# EAGLE design PCBMINI2 (EAGLE 9.2.0)
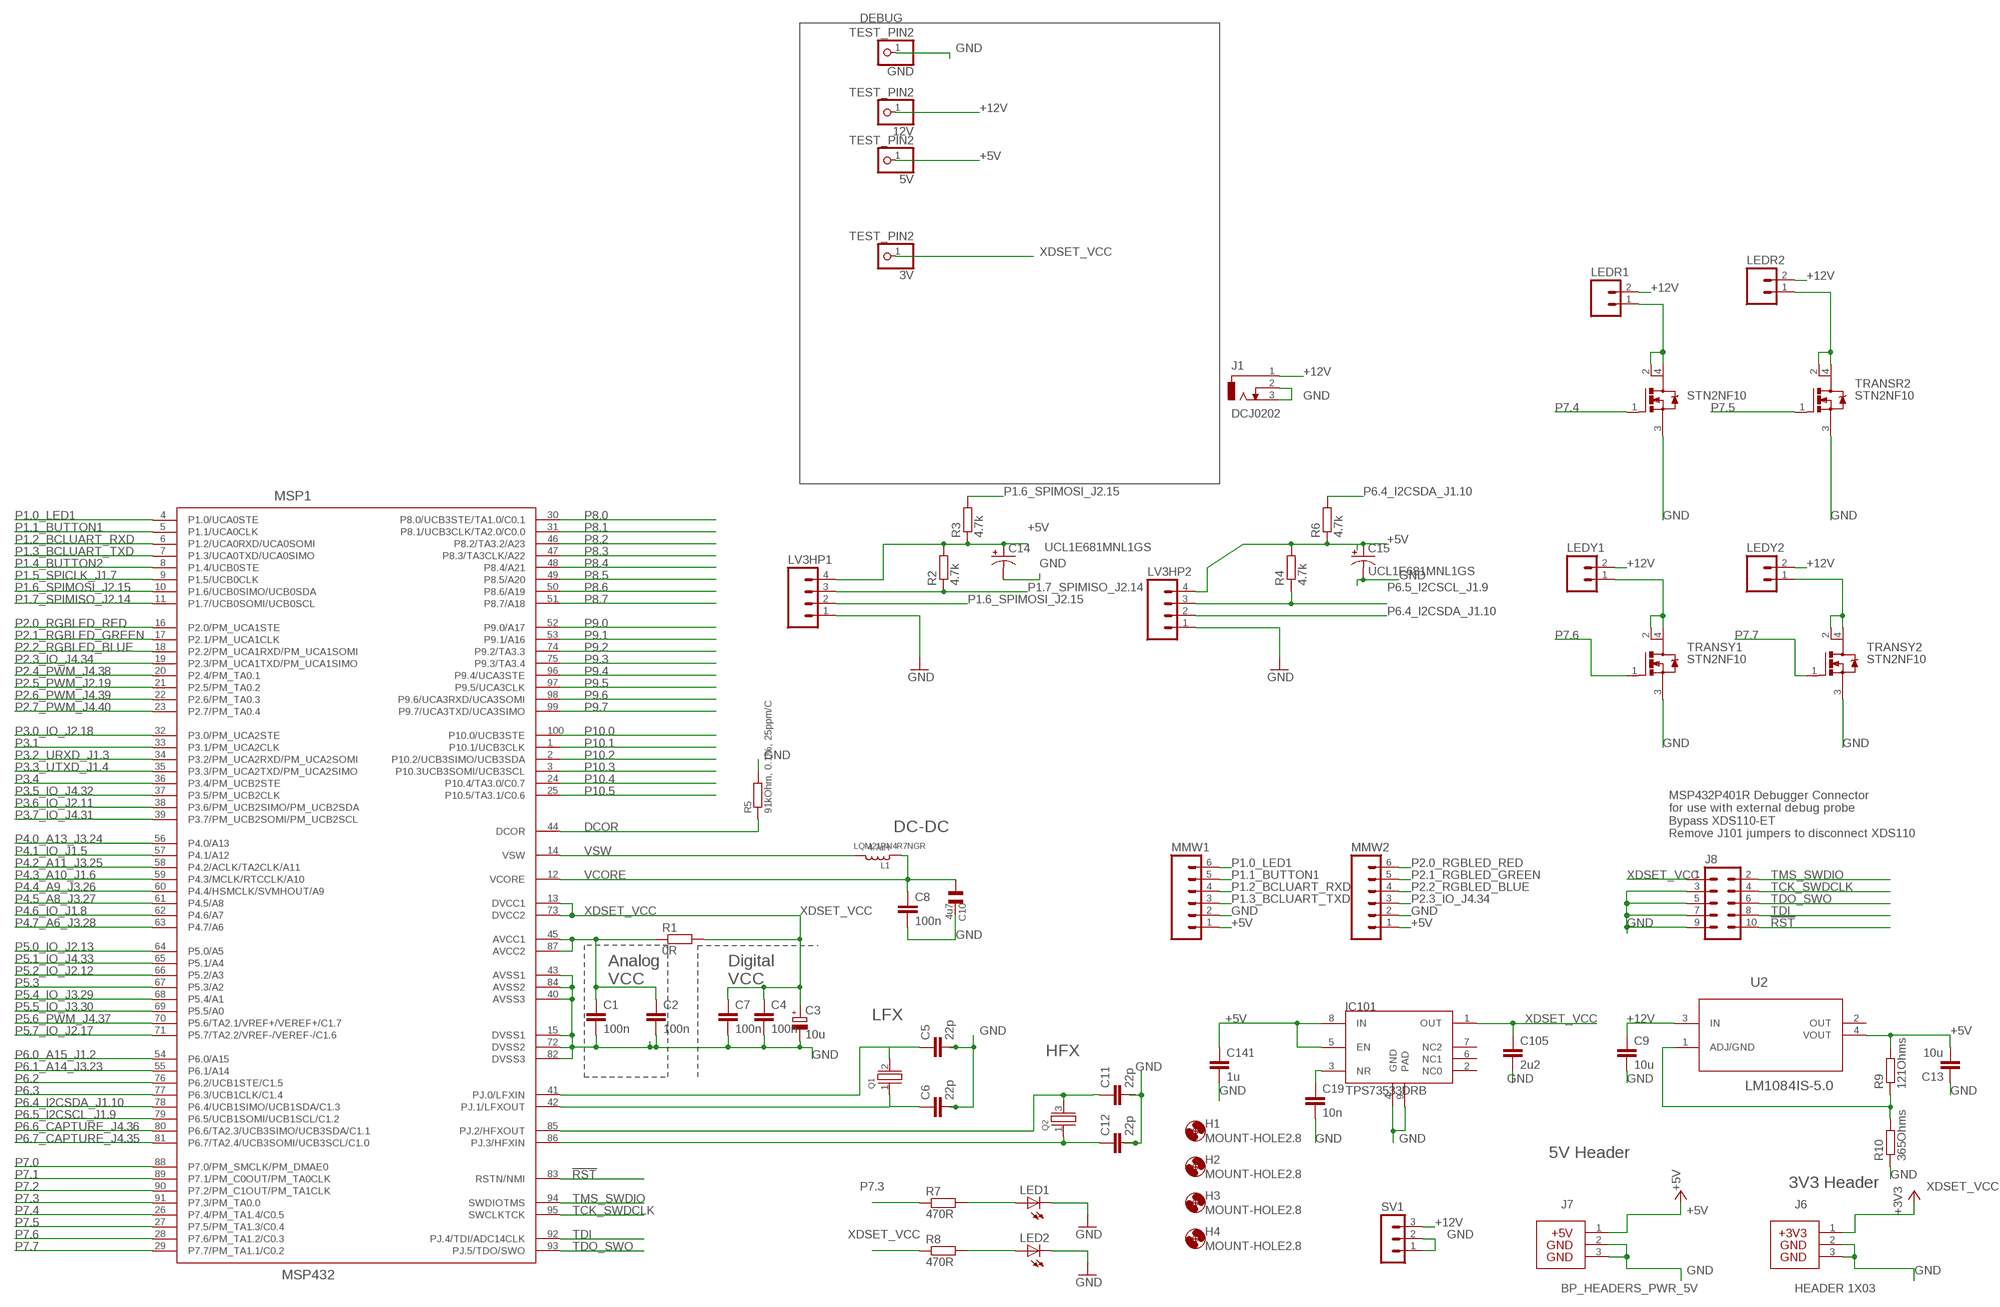
[diagram p0: schematic, sheet 1, part 1 of 2]
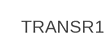
[diagram p1: schematic, sheet 1, part 2 of 2]

## Parts
3V  TEST_PIN2  PINHD-1X1  [1X01]
5V  TEST_PIN2  PINHD-1X1  [1X01]
12V  TEST_PIN2  PINHD-1X1  [1X01]
C1  100n  C  [C0805]
C2  100n  C  [C0805]
C3  10u  CPOL-EUA/3216-18R  [A/3216-18R]
C4  100n  C  [C0805]
C5  22p  C  [C0805]
C6  22p  C  [C0805]
C7  100n  C  [C0805]
C8  100n  C  [C0805]
C9  10u  C  [C0805]
C10  4u7  CSMD0805  [CSMD0805]
C11  22p  C  [C0805]
C12  22p  C  [C0805]
C13  10u  C  [C0805]
C14  UCL1E681MNL1GS  [CAPAE1030X1350N]
C15  UCL1E681MNL1GS  [CAPAE1030X1350N]
C19  10n  C-EUC0603  [C0603]
C105  2u2  C-EUC0603  [C0603]
C141  1u  C-EUC0603  [C0603]
GND  TEST_PIN2  PINHD-1X1  [1X01]
H1  MOUNT-HOLE2.8  [2,8]
H2  MOUNT-HOLE2.8  [2,8]
H3  MOUNT-HOLE2.8  [2,8]
H4  MOUNT-HOLE2.8  [2,8]
IC101  TPS73533DRB  TPS73633DRB  [SON8]
J1  DCJ0202  [DCJ0202]
J6  HEADER 1X03  BP_HEADERS_PWR_3V3100-TH  [3PIN_PWR_3V3]
J7  BP_HEADERS_PWR_5V  [3PIN_PWR_5V]
J8  DEBUG_ARM-10  [ARM-10]
L1  4.7uH  LQM2MP_G0  [0806]
LED1  LED_E  [LED_1206]
LED2  LED_E  [LED_1206]
LEDR1  MA02  [02PA]
LEDR2  MA02  [02PA]
LEDY1  MA02  [02PA]
LEDY2  MA02  [02PA]
LV3HP1  MA04  [04PA]
LV3HP2  MA04  [04PA]
MMW1  MA06  [06PA]
MMW2  MA06  [06PA]
MSP1  MSP432  [PZ100]
Q1  CRYSTALLF_GENERAL  [LF_XTAL]
Q2  CRYSTALEPSON_FA-238  [FA-238]
R1  0R  R  [R0805]
R2  4.7k  R  [R0805]
R3  4.7k  R  [R0805]
R4  4.7k  R  [R0805]
R5  91kOhm, 0.1%, 25ppm/C  R_0805  [0805]
R6  4.7k  R  [R0805]
R7  470R  R  [R0805]
R8  470R  R  [R0805]
R9  121Ohms  R  [R0805]
R10  365Ohms  R  [R0805]
SV1  MA03-1  [MA03-1]
TRANSR1  STN2NF10  [SOT230P700X180-4N]
TRANSR2  STN2NF10  [SOT230P700X180-4N]
TRANSY1  STN2NF10  [SOT230P700X180-4N]
TRANSY2  STN2NF10  [SOT230P700X180-4N]
U2  LM1084IS-5.0  [TO254P1435X457-3N]

## Nets
!RST: J8.10 MSP1.83(RSTN/NMI)
+5V: 5V.1 C13.2 C14.A(+) C15.A(+) C141.1 IC101.5(EN) IC101.8(IN) J7.1 LV3HP1.4 LV3HP2.4 MMW1.1 MMW2.1 R2.2 R3.1 R4.2 R6.1 R9.2 U2.4(VOUT)
+12V: 12V.1 C9.1 J1.1 LEDR1.2 LEDR2.2 LEDY1.2 LEDY2.2 SV1.3 U2.3(IN)
DCOR: MSP1.44(DCOR) R5.1
GND: C1.2 C2.2 C3.- C4.2 C5.2 C6.2 C7.2 C8.2 C9.2 C10.2 C11.2 C12.2 C13.1 C14.C(-) C15.C(-) C19.2 C105.2 C141.2 GND.1 IC101.4(GND) IC101.9(PAD) J1.2 J1.3 J6.2 J6.3 J7.2 J7.3 J8.3 J8.5 J8.7 J8.9 LED1.C LED2.C LV3HP1.1 LV3HP2.1 MMW1.2 MMW2.2 MSP1.15(DVSS1) MSP1.40(AVSS3) MSP1.43(AVSS1) MSP1.72(DVSS2) MSP1.82(DVSS3) MSP1.84(AVSS2) R5.2 R10.1 SV1.1 SV1.2 TRANSR1.3(S) TRANSR2.3(S) TRANSY1.3(S) TRANSY2.3(S)
N$1: LEDY2.1 TRANSY2.2(D) TRANSY2.4(D)
N$2: LED1.A R7.2
N$3: LED2.A R8.2
N$6: C1.1 C2.1 MSP1.45(AVCC1) MSP1.87(AVCC2) R1.1
N$7: R9.1 R10.2 U2.1(ADJ/GND)
N$11: C19.1 IC101.3(NR)
N$34: C6.1 MSP1.42(PJ.1/LFXOUT) Q1.1
N$38: C5.1 MSP1.41(PJ.0/LFXIN) Q1.2
P1.0_LED1: MMW1.6 MSP1.4(P1.0/UCA0STE)
P1.1_BUTTON1: MMW1.5 MSP1.5(P1.1/UCA0CLK)
P1.2_BCLUART_RXD: MMW1.4 MSP1.6(P1.2/UCA0RXD/UCA0SOMI)
P1.3_BCLUART_TXD: MMW1.3 MSP1.7(P1.3/UCA0TXD/UCA0SIMO)
P1.4_BUTTON2: MSP1.8(P1.4/UCB0STE)
P1.5_SPICLK_J1.7: MSP1.9(P1.5/UCB0CLK)
P1.6_SPIMOSI_J2.15: LV3HP1.2 MSP1.10(P1.6/UCB0SIMO/UCB0SDA) R3.2
P1.7_SPIMISO_J2.14: LV3HP1.3 MSP1.11(P1.7/UCB0SOMI/UCB0SCL) R2.1
P2.0_RGBLED_RED: MMW2.6 MSP1.16(P2.0/PM_UCA1STE)
P2.1_RGBLED_GREEN: MMW2.5 MSP1.17(P2.1/PM_UCA1CLK)
P2.2_RGBLED_BLUE: MMW2.4 MSP1.18(P2.2/PM_UCA1RXD/PM_UCA1SOMI)
P2.3_IO_J4.34: MMW2.3 MSP1.19(P2.3/PM_UCA1TXD/PM_UCA1SIMO)
P2.4_PWM_J4.38: MSP1.20(P2.4/PM_TA0.1)
P2.5_PWM_J2.19: MSP1.21(P2.5/PM_TA0.2)
P2.6_PWM_J4.39: MSP1.22(P2.6/PM_TA0.3)
P2.7_PWM_J4.40: MSP1.23(P2.7/PM_TA0.4)
P3.0_IO_J2.18: MSP1.32(P3.0/PM_UCA2STE)
P3.1: MSP1.33(P3.1/PM_UCA2CLK)
P3.2_URXD_J1.3: MSP1.34(P3.2/PM_UCA2RXD/PM_UCA2SOMI)
P3.3_UTXD_J1.4: MSP1.35(P3.3/PM_UCA2TXD/PM_UCA2SIMO)
P3.4: MSP1.36(P3.4/PM_UCB2STE)
P3.5_IO_J4.32: MSP1.37(P3.5/PM_UCB2CLK)
P3.6_IO_J2.11: MSP1.38(P3.6/PM_UCB2SIMO/PM_UCB2SDA)
P3.7_IO_J4.31: MSP1.39(P3.7/PM_UCB2SOMI/PM_UCB2SCL)
P4.0_A13_J3.24: MSP1.56(P4.0/A13)
P4.1_IO_J1.5: MSP1.57(P4.1/A12)
P4.2_A11_J3.25: MSP1.58(P4.2/ACLK/TA2CLK/A11)
P4.3_A10_J1.6: MSP1.59(P4.3/MCLK/RTCCLK/A10)
P4.4_A9_J3.26: MSP1.60(P4.4/HSMCLK/SVMHOUT/A9)
P4.5_A8_J3.27: MSP1.61(P4.5/A8)
P4.6_IO_J1.8: MSP1.62(P4.6/A7)
P4.7_A6_J3.28: MSP1.63(P4.7/A6)
P5.0_IO_J2.13: MSP1.64(P5.0/A5)
P5.1_IO_J4.33: MSP1.65(P5.1/A4)
P5.2/XT2IN: C12.1 MSP1.86(PJ.3/HFXIN) Q2.1
P5.2_IO_J2.12: MSP1.66(P5.2/A3)
P5.3: MSP1.67(P5.3/A2)
P5.3/XT2OUT: C11.1 MSP1.85(PJ.2/HFXOUT) Q2.3
P5.4_IO_J3.29: MSP1.68(P5.4/A1)
P5.5_IO_J3.30: MSP1.69(P5.5/A0)
P5.6_PWM_J4.37: MSP1.70(P5.6/TA2.1/VREF+/VEREF+/C1.7)
P5.7_IO_J2.17: MSP1.71(P5.7/TA2.2/VREF-/VEREF-/C1.6)
P6.0_A15_J1.2: MSP1.54(P6.0/A15)
P6.1_A14_J3.23: MSP1.55(P6.1/A14)
P6.2: MSP1.76(P6.2/UCB1STE/C1.5)
P6.3: MSP1.77(P6.3/UCB1CLK/C1.4)
P6.4_I2CSDA_J1.10: LV3HP2.2 MSP1.78(P6.4/UCB1SIMO/UCB1SDA/C1.3) R6.2
P6.5_I2CSCL_J1.9: LV3HP2.3 MSP1.79(P6.5/UCB1SOMI/UCB1SCL/C1.2) R4.1
P6.6_CAPTURE_J4.36: MSP1.80(P6.6/TA2.3/UCB3SIMO/UCB3SDA/C1.1)
P6.7_CAPTURE_J4.35: MSP1.81(P6.7/TA2.4/UCB3SOMI/UCB3SCL/C1.0)
P7.0: MSP1.88(P7.0/PM_SMCLK/PM_DMAE0)
P7.1: MSP1.89(P7.1/PM_C0OUT/PM_TA0CLK)
P7.2: MSP1.90(P7.2/PM_C1OUT/PM_TA1CLK)
P7.3: MSP1.91(P7.3/PM_TA0.0) R7.1
P7.4: MSP1.26(P7.4/PM_TA1.4/C0.5) TRANSR1.1(G)
P7.5: MSP1.27(P7.5/PM_TA1.3/C0.4) TRANSR2.1(G)
P7.6: MSP1.28(P7.6/PM_TA1.2/C0.3) TRANSY1.1(G)
P7.7: MSP1.29(P7.7/PM_TA1.1/C0.2) TRANSY2.1(G)
P8.0: MSP1.30(P8.0/UCB3STE/TA1.0/C0.1)
P8.1: MSP1.31(P8.1/UCB3CLK/TA2.0/C0.0)
P8.2: MSP1.46(P8.2/TA3.2/A23)
P8.3: MSP1.47(P8.3/TA3CLK/A22)
P8.4: MSP1.48(P8.4/A21)
P8.5: MSP1.49(P8.5/A20)
P8.6: MSP1.50(P8.6/A19)
P8.7: MSP1.51(P8.7/A18)
P9.0: MSP1.52(P9.0/A17)
P9.1: MSP1.53(P9.1/A16)
P9.2: MSP1.74(P9.2/TA3.3)
P9.3: MSP1.75(P9.3/TA3.4)
P9.4: MSP1.96(P9.4/UCA3STE)
P9.5: MSP1.97(P9.5/UCA3CLK)
P9.6: MSP1.98(P9.6/UCA3RXD/UCA3SOMI)
P9.7: MSP1.99(P9.7/UCA3TXD/UCA3SIMO)
P10.0: MSP1.100(P10.0/UCB3STE)
P10.1: MSP1.1(P10.1/UCB3CLK)
P10.2: MSP1.2(P10.2/UCB3SIMO/UCB3SDA)
P10.3: MSP1.3(P10.3UCB3SOMI/UCB3SCL)
P10.4: MSP1.24(P10.4/TA3.0/C0.7)
P10.5: MSP1.25(P10.5/TA3.1/C0.6)
R1: LEDR1.1 TRANSR1.2(D) TRANSR1.4(D)
R2: LEDR2.1 TRANSR2.2(D) TRANSR2.4(D)
TCK_SWDCLK: J8.4 MSP1.95(SWCLKTCK)
TDI: J8.8 MSP1.92(PJ.4/TDI/ADC14CLK)
TDO_SWO: J8.6 MSP1.93(PJ.5/TDO/SWO)
TMS_SWDIO: J8.2 MSP1.94(SWDIOTMS)
VCORE: C8.1 C10.1 L1.1 MSP1.12(VCORE)
VSW: L1.2 MSP1.14(VSW)
XDSET_VCC: 3V.1 C3.+ C4.1 C7.1 C105.1 IC101.1(OUT) J6.1 J8.1 MSP1.13(DVCC1) MSP1.73(DVCC2) R1.2 R8.1 ; supply symbol labelled +3V3
Y1: LEDY1.1 TRANSY1.2(D) TRANSY1.4(D)
Unconnected: IC101.2(NC0) IC101.6(NC1) IC101.7(NC2) U2.2(OUT)

## Notes on the sheet
- DEBUG
- DC-DC
- MSP432P401R Debugger Connector
  for use with external debug probe
  Bypass XDS110-ET
  Remove J101 jumpers to disconnect XDS110
- LQM21PN4R7NGR
- Analog | Digital
- VCC | VCC
- LFX
- HFX
- 5V Header
- 3V3 Header

## Library data of the parts
3V 5V 12V GND = pinhead:PINHD-1X1: PIN HEADER
C1 C2 C4-C9 C11-C13 = eagle-ltspice:C: CAPACITOR, European symbol; SPICEMODEL: NONE; SPICEPREFIX: C
C3 = rcl:CPOL-EU: POLARIZED CAPACITOR, European symbol
C10 = cap:CSMD0805
C14 C15 = UCL1E681MNL1GS:UCL1E681MNL1GS: Cap Aluminum Lytic 680uF 25V 20% (10 X 13.5mm) SMD 1190mA 2000h 105C Automotive T/R; AVAILABILITY: Unavailable; DESCRIPTION: Cap Aluminum Lytic 680uF 25V 20% _10 X 13.5mm_ SMD 1190mA 2000h 105C Automotive T/R; MF: Nichicon; MP: UCL1E681MNL1GS; PACKAGE: Radial Nichicon; PRICE: None
C19 C105 C141 = rcl:C-EU: CAPACITOR, European symbol
H1-H4 = holes:MOUNT-HOLE: MOUNTING HOLE with drill center marker
IC101 = MSP430G6_LP:TPS73633DRB
J1 = con-jack:DCJ0202: DC POWER JACK Source: DCJ0202.pdf; OC_FARNELL: unknown; OC_NEWARK: unknown
J6 = LaunchPad_Template_Library:BP_HEADERS_PWR_3V3; CCO: 258-0001299; DESCRIPTION: CONN HEADER .100 SINGL STR 3POS; MAN: SULLINS
J7 = LaunchPad_Template_Library:BP_HEADERS_PWR_5V
J8 = MSP430_Headers:DEBUG_ARM-10; SAMTEC: FTSH-105-01-F-D-K
L1 = Murata:LQM2MP_G0
LED1 LED2 = eagle-ltspice:LED_E: LED Source: http://www.osram.convergy.de Source: www.luxeon.com Source: www.kingbright.com; SPICEMODEL: NONE; SPICEPREFIX: D; SPICETYPE: diode
LEDR1 LEDR2 LEDY1 LEDY2 = con-amp-quick:MA02: AMP QUICK CONNECTOR; OC_FARNELL: unknown; OC_NEWARK: unknown
LV3HP1 LV3HP2 = con-amp-quick:MA04: AMP QUICK CONNECTOR; OC_FARNELL: unknown; OC_NEWARK: unknown
MMW1 MMW2 = con-amp-quick:MA06: AMP QUICK CONNECTOR; OC_FARNELL: unknown; OC_NEWARK: unknown
MSP1 = MSP-EXP432:MSP432
Q1 Q2 = MSP_Crystals:CRYSTAL
R1-R4 R6-R10 = eagle-ltspice:R: RESISTOR, European symbol; SPICEMODEL: NONE; SPICEPREFIX: R
R5 = smd:R_0805
SV1 = con-lstb:MA03-1: PIN HEADER; OC_FARNELL: unknown; OC_NEWARK: unknown
TRANSR1 TRANSR2 TRANSY1 TRANSY2 = STN2NF10:STN2NF10: N-channel 100 V, 0.23 Ohm, 2.4 A STripFET(TM) II POWER MOSFET in SOT-223 package; AVAILABILITY: Unavailable; DESCRIPTION: N-channel 100 V, 0.23 Ohm, 2.4 A STripFET_TM_ II POWER MOSFET in SOT-223 package; MF: STMicroelectronics; MP: STN2NF10; PACKAGE: SOT-223 STMicroelectronics; PRICE: None
U2 = LM1084IS-5.0:LM1084IS-5.0: Low Dropout Positive Regulators; AVAILABILITY: Unavailable; DESCRIPTION: The LM1084 is a series of low dropout voltage positive regulators with a maximum dropout of 1.5V at 5A of load curren...; MF: Rohm; MP: LM1084IS-5.0; PACKAGE: None; PRICE: None

## Net classes
0 default: width 0.254 mm
2 Power: width 0.203 mm, drill 0.305 mm, clearance 0.152 mm to class 0, clearance 0.152 mm to class 1, clearance 0.152 mm

## Board
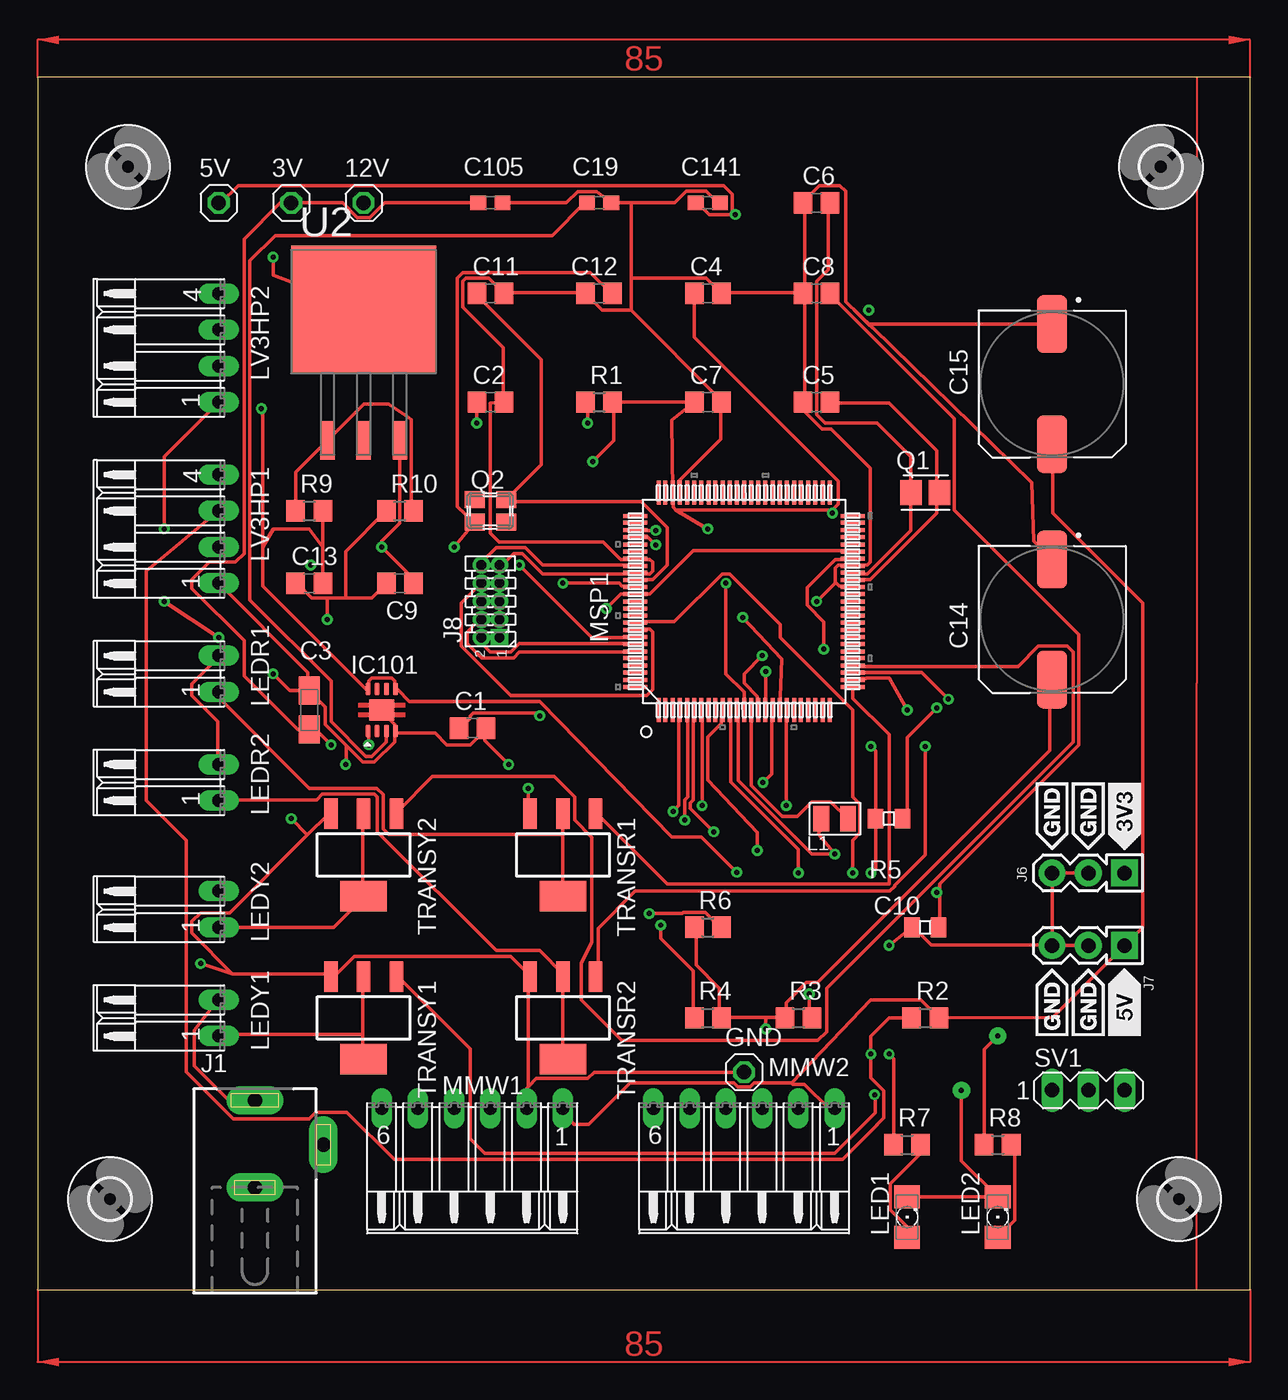
[diagram p2: board, top side]
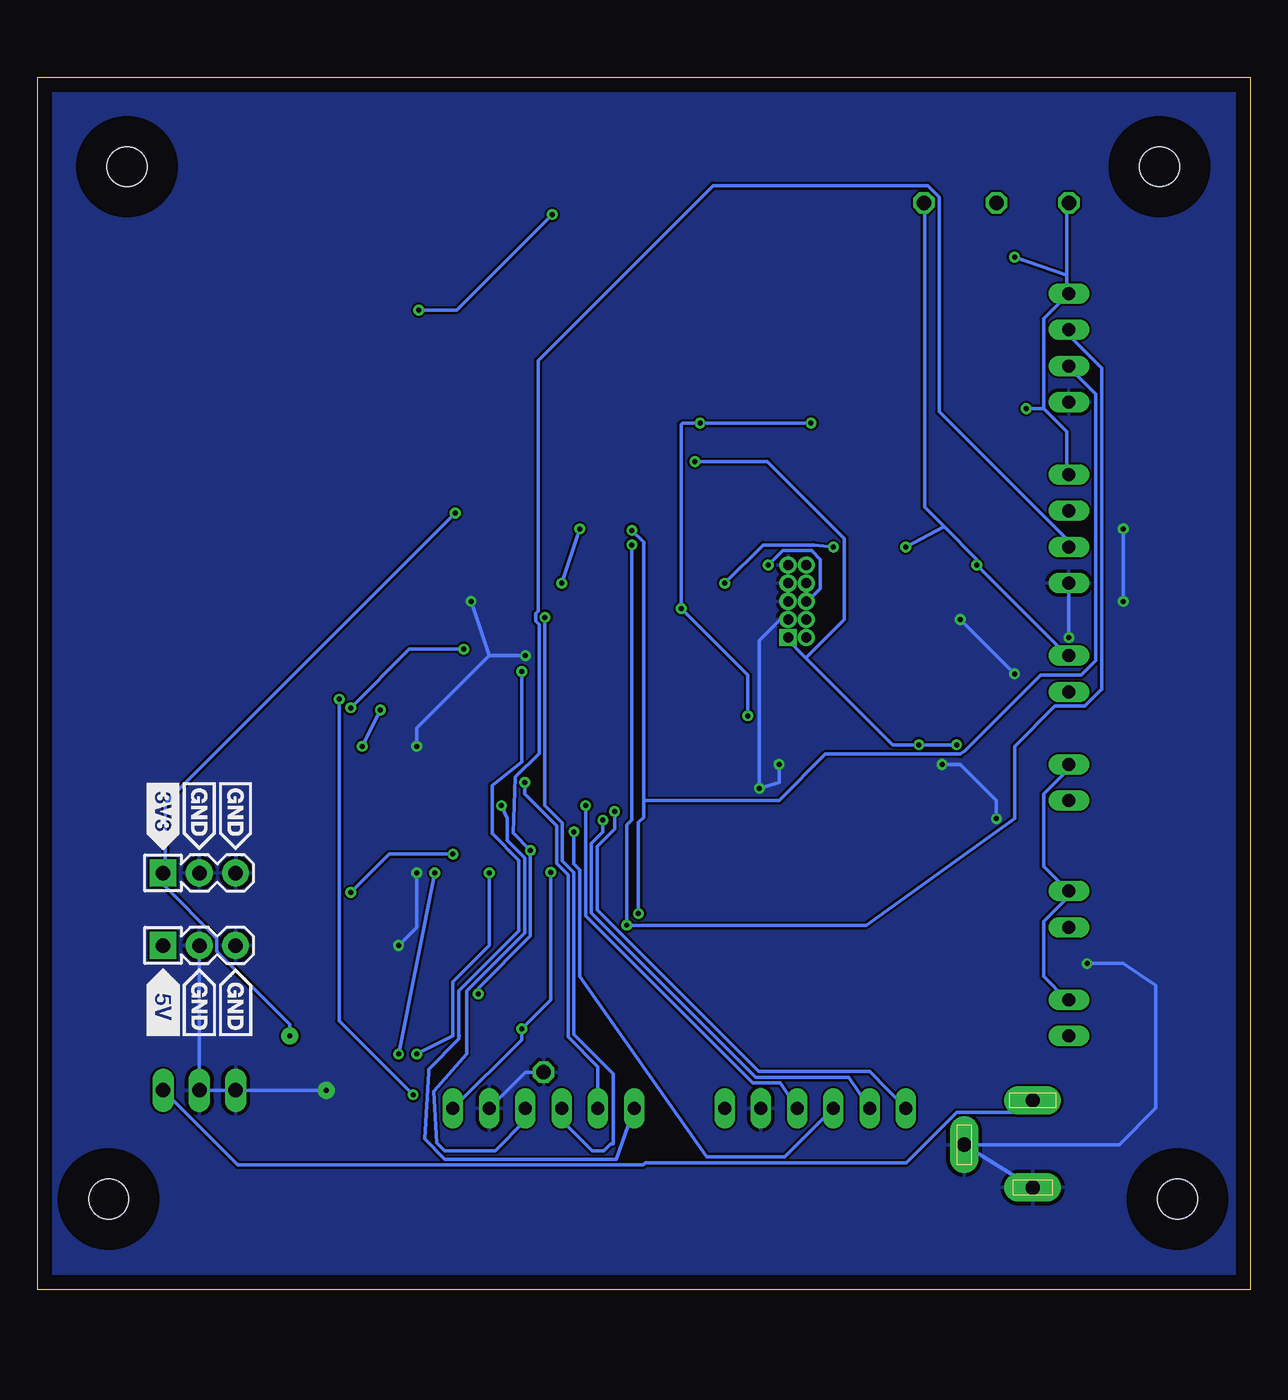
[diagram p3: board, bottom side, seen from below]

Size 85 x 85 mm. Coordinates in mm from the lower left corner, seen from the top.
Outline: 0,0 85,0 85,85 0,85 0,0
Copper layers (1*16): Top 0.035mm / dielectric 1.5mm / Bottom 0.035mm
Design rules "default": minimum track width 6mil, minimum drill 0.35mm, track to track 6mil, track to pad 6mil, pad to pad 6mil, via to via 6mil, smd to smd 6mil, copper to edge 40mil, drill to drill 6mil, minimum pad ring 10mil, minimum via ring 8mil, stop-mask expansion 4mil, vias tented up to drill 0mil, thermal gap 10mil

### Footprints (pad centres in the part's own frame; a part is rotated, then mirrored left to right if it is on the bottom)
1X01 = drill 1.016 octagon: 1 0,0
C0805 = smd 1.3 x 1.5: 1 -0.95,0; 2 0.95,0
A/3216-18R = smd 1.95 x 1.5: + 1.375,0; - -1.375,0
CSMD0805 = smd 1.092 x 1.397: 1 -0.94,0; 2 0.94,0
CAPAE1030X1350N = smd 4.04 x 2.12: A 4.215,0; C -4.215,0
C0603 = smd 1.1 x 1: 1 -0.85,0; 2 0.85,0
2,8 = hole 2.8: 0,0
SON8 = smd 0.85 x 0.35: 1 -1.475,0.975; 2 -1.475,0.325; 3 -1.475,-0.325; 4 -1.475,-0.975; 5 1.475,-0.975; 6 1.475,-0.325; 7 1.475,0.325; 8 1.475,0.975 | smd 1.5 x 1.75: 9 0,0
DCJ0202 = drill 1 pad 2 long: 1 0,3.1; 2 4.8,0; 3 0,-3
3PIN_PWR_3V3 = drill 1.016 pad 1.88 square: 1 0,0 | drill 1.016 pad 1.88: 2 0,2.54; 3 0,5.08
3PIN_PWR_5V = drill 1.016 pad 1.88 square: 1 0,0 | drill 1.016 pad 1.88: 2 0,2.54; 3 0,5.08
ARM-10 = drill 0.7 pad 0.95 square: 1 -2.54,-0.635 | drill 0.7 pad 0.95: 2 -2.54,0.635; 3 -1.27,-0.635; 4 -1.27,0.635; 5 0,-0.635; 6 0,0.635; 7 1.27,-0.635; 8 1.27,0.635; 9 2.54,-0.635; 10 2.54,0.635
0806 = smd 1.1 x 1.8: 1 -0.94,0; 2 0.94,0
LED_1206 = smd 1.6 x 1.803: A -1.422,0; C 1.422,0
02PA = drill 0.914 long: 1 -1.27,0; 2 1.27,0
04PA = drill 0.914 long: 1 -3.81,0; 2 -1.27,0; 3 1.27,0; 4 3.81,0
06PA = drill 0.914 long: 1 -6.35,0; 2 -3.81,0; 3 -1.27,0; 4 1.27,0; 5 3.81,0; 6 6.35,0
PZ100 = smd 1.676 x 0.279: 1 -7.62,5.994; 2 -7.62,5.512; 3 -7.62,5.004; 4 -7.62,4.496; 5 -7.62,3.988; 6 -7.62,3.505; 7 -7.62,2.997; 8 -7.62,2.489; 9 -7.62,2.007; 10 -7.62,1.499; 11 -7.62,0.991; 12 -7.62,0.508; 13 -7.62,0; 14 -7.62,-0.508; 15 -7.62,-0.991; 16 -7.62,-1.499; 17 -7.62,-2.007; 18 -7.62,-2.489; 19 -7.62,-2.997; 20 -7.62,-3.505; 21 -7.62,-3.988; 22 -7.62,-4.496; 23 -7.62,-5.004; 24 -7.62,-5.512; 25 -7.62,-5.994; 51 7.62,-5.994; 52 7.62,-5.512; 53 7.62,-5.004; 54 7.62,-4.496; 55 7.62,-3.988; 56 7.62,-3.505; 57 7.62,-2.997; 58 7.62,-2.489; 59 7.62,-2.007; 60 7.62,-1.499; 61 7.62,-0.991; 62 7.62,-0.508; 63 7.62,0; 64 7.62,0.508; 65 7.62,0.991; 66 7.62,1.499; 67 7.62,2.007; 68 7.62,2.489; 69 7.62,2.997; 70 7.62,3.505; 71 7.62,3.988; 72 7.62,4.496; 73 7.62,5.004; 74 7.62,5.512; 75 7.62,5.994 | smd 0.279 x 1.676: 26 -5.994,-7.62; 27 -5.512,-7.62; 28 -5.004,-7.62; 29 -4.496,-7.62; 30 -3.988,-7.62; 31 -3.505,-7.62; 32 -2.997,-7.62; 33 -2.489,-7.62; 34 -2.007,-7.62; 35 -1.499,-7.62; 36 -0.991,-7.62; 37 -0.508,-7.62; 38 0,-7.62; 39 0.508,-7.62; 40 0.991,-7.62; 41 1.499,-7.62; 42 2.007,-7.62; 43 2.489,-7.62; 44 2.997,-7.62; 45 3.505,-7.62; 46 3.988,-7.62; 47 4.496,-7.62; 48 5.004,-7.62; 49 5.512,-7.62; 50 5.994,-7.62; 76 5.994,7.62; 77 5.512,7.62; 78 5.004,7.62; 79 4.496,7.62; 80 3.988,7.62; 81 3.505,7.62; 82 2.997,7.62; 83 2.489,7.62; 84 2.007,7.62; 85 1.499,7.62; 86 0.991,7.62; 87 0.508,7.62; 88 0,7.62; 89 -0.508,7.62; 90 -0.991,7.62; 91 -1.499,7.62; 92 -2.007,7.62; 93 -2.489,7.62; 94 -2.997,7.62; 95 -3.505,7.62; 96 -3.988,7.62; 97 -4.496,7.62; 98 -5.004,7.62; 99 -5.512,7.62; 100 -5.994,7.62
LF_XTAL = smd 1.75 x 1.5: 1 0,1; 2 0,-1
FA-238 = smd 1.4 x 1.2: 1 -1.1,-0.8; 2 1.1,-0.8; 3 1.1,0.8; 4 -1.1,0.8
R0805 = smd 1.3 x 1.5: 1 -0.95,0; 2 0.95,0
0805 = smd 1.092 x 1.397: 1 -0.94,0; 2 0.94,0
MA03-1 = drill 1.016 long: 1 -2.54,0; 2 0,0; 3 2.54,0
SOT230P700X180-4N = smd 2.15 x 0.95: 1 -2.9,2.3; 2 -2.9,0; 3 -2.9,-2.3 | smd 2.15 x 3.25: 4 2.9,0
TO254P1435X457-3N = smd 1.016 x 2.692: 1 -2.54,-9.042; 2 0,-9.042; 3 2.54,-9.042 | smd 10.16 x 8.941: 4 0,0.152

### Placement (x,y rotation side)
3V  17.78,76.2 0 top
5V  12.7,76.2 0 top
12V  22.86,76.2 0 top
C1  30.48,39.37 0 top
C2  31.75,62.23 0 top
C3  19.05,40.64 270 top
C4  46.99,69.85 0 top
C5  54.61,62.23 180 top
C6  54.61,76.2 180 top
C7  46.99,62.23 0 top
C8  54.61,69.85 180 top
C9  25.4,49.53 180 top
C10  62.23,25.4 180 top
C11  31.75,69.85 0 top
C12  39.37,69.85 180 top
C13  19.05,49.53 0 top
C14  71.12,46.99 270 top
C15  71.12,63.5 270 top
C19  39.37,76.2 0 top
C105  31.75,76.2 0 top
C141  46.99,76.2 0 top
GND  49.53,15.24 0 top
H1  80.01,6.35 0 top
H2  78.74,78.74 90 top
H3  6.35,78.74 0 top
H4  5.08,6.35 0 top
IC101  24.13,40.64 90 top
J1  15.24,10.16 0 top
J6  76.2,29.21 90 top
J7  76.2,24.13 90 top
J8  31.75,48.26 90 top
L1  55.88,33.02 0 top
LED1  60.96,5.08 90 top
LED2  67.31,5.08 90 top
LEDR1  12.7,43.18 90 top
LEDR2  12.7,35.56 90 top
LEDY1  12.7,19.05 90 top
LEDY2  12.7,26.67 90 top
LV3HP1  12.7,53.34 90 top
LV3HP2  12.7,66.04 90 top
MMW1  30.48,12.7 180 top
MMW2  49.53,12.7 180 top
MSP1  49.53,48.26 90 top
Q1  62.23,55.88 90 top
Q2  31.75,54.61 0 top
R1  39.37,62.23 0 top
R2  62.23,19.05 0 top
R3  53.34,19.05 0 top
R4  46.99,19.05 0 top
R5  59.69,33.02 180 top
R6  46.99,25.4 0 top
R7  60.96,10.16 0 top
R8  67.31,10.16 0 top
R9  19.05,54.61 0 top
R10  25.4,54.61 0 top
SV1  73.66,13.97 0 top
TRANSR1  36.83,30.48 270 top
TRANSR2  36.83,19.05 270 top
TRANSY1  22.86,19.05 270 top
TRANSY2  22.86,30.48 270 top
U2  22.86,68.58 0 top

### Tracks (layer width: path | path; a pad name or v marks a point on that pad's centre or on a via)
!RST
  Top 0.254: MSP1.83 41.91,50.8 35.41,50.8 34.19,52.02 32.16,52.02 30.94,50.8 J8.10
+5V  (via drill 0.35)
  Top 0.254: 48.72,75.59 48.51,75.39 47.09,75.39 46.28,76.2 C141.1 | 48.72,75.59 48.72,76.81 48.11,77.42 14.07,77.42 12.85,76.2 5V.1 | v48.92,75.39 48.72,75.59 | 51.05,19.1 52.27,19.1 R3.1 52.48,19.1 52.48,20.12 53.9,21.54 54.71,21.54 70.97,37.8 70.97,42.67 C14.A | 51.05,19.1 48.01,19.1 R4.2 47.8,19.1 47.8,21.13 46.18,22.76 46.18,25.4 R6.1 | MMW1.1 37.58,11.58 38.66,11.58 41.55,14.48 48.82,14.48 49.1,14.2 49.96,14.2 50.24,14.48 52.87,14.48 | C15.A 71.17,59.23 71.17,54.46 77.47,48.16 77.47,25.4 J7.1 71.17,19.1 R2.2 61.91,20.32 58.42,20.32 52.87,14.48 | v51.05,18.29 51.05,19.1 | v15.7,61.77 15.8,61.67 15.8,52.07 | 15.8,52.07 15.8,49.33 23.01,42.12 IC101.8 23.22,42.27 23.22,42.67 23.42,42.88 24.84,42.88 25.04,42.67 25.04,42.27 IC101.5 25.25,42.06 26.06,41.25 35.2,41.25 44.45,31.75 46.53,31.75 v49.02,29.26 | C13.2 20,52.07 | 20,52.07 R9.2 | 15.8,52.07 16.51,53.34 19.05,53.34 20,52.07 | U2.4 16.51,71.12 v16.51,72.39 | 52.87,14.48 52.95,14.4 53.75,14.4 55.45,12.7 MMW2.1
  Bottom 0.254: 14.48,61.77 12.85,60.15 12.85,57.3 LV3HP1.4 | 14.48,61.77 14.48,68.07 LV3HP2.4 12.85,69.9 12.85,71.12 | v58.27,68.68 55.63,68.68 v48.92,75.39 | 12.85,71.12 12.85,76.2 5V.1 | 14.48,61.77 v15.7,61.77 | MMW2.1 51.05,17.53 v51.05,18.29 49.02,20.32 v49.02,29.26 | v16.51,72.39 12.85,71.12
+12V  (via drill 0.35)
  Top 0.254: LEDR2.2 12.65,36.98 12.65,39.83 10.82,41.66 10.82,42.47 12.65,44.3 LEDR1.2 | LEDY1.2 12.65,20.32 11,18.19 11,15.67 13.41,13.26 J1.1 | U2.3 25.38,59.52 25.38,53.74 24.13,52.49 v24.13,52.07 26.35,49.85 C9.1
  Bottom 0.254: LEDR1.2 12.85,44.5 v19.15,50.8 19.15,51.21 21.44,53.49 | 21.44,53.49 22.81,54.86 22.81,76.2 12V.1 | LEDY1.2 12.85,20.32 14.48,21.95 14.48,25.81 12.85,27.43 12.85,27.84 LEDY2.2 12.85,28.04 14.48,29.67 14.48,34.75 12.85,36.37 12.85,36.78 LEDR2.2 | SV1.3 70.97,8.74 42.55,8.74 42.4,8.89 24.12,8.89 20.57,12.44 16.06,12.44 J1.1 | v24.13,52.07 21.44,53.49
DCOR  (via drill 0.35)
  Top 0.254: MSP1.44 57.15,51.21 55.93,51.21 53.95,49.23 53.95,47.99 55.12,46.82 v55.12,44.91 | R5.1 60.96,33.35 60.96,38.71 v63.04,40.79
  Bottom 0.254: v63.04,40.79 58.93,44.91 v55.12,44.91
GND  (via drill 0.35, 0.35 pad 0.75, 0.35 pad 1.2)
  Top 0.254: C14.C 69.84,52.49 69.7,56.59 58.55,67.44 | 55.93,49.53 55.93,50.6 56.13,50.8 57.15,50.8 | C8.2 53.8,69.7 53.8,62.38 C5.2 53.8,62.18 53.8,61.57 55.02,60.35 55.63,60.35 58.37,57.61 58.37,51 58.17,50.8 57.15,50.8 | C8.2 53.59,69.9 48.11,69.9 C4.2 47.9,69.9 46.89,70.92 41.61,70.92 | C8.2 53.8,69.9 53.8,76.2 C6.2 53.59,76.2 54.81,77.42 56.24,77.42 56.64,77.01 56.64,69.29 58.55,67.44 | 41.61,76.2 44.65,76.2 45.47,77.01 46.89,77.01 47.7,76.2 C141.2 | 41.61,76.2 C19.2 39.19,76.98 37.85,76.98 37.08,76.2 C105.2 | MSP1.72 44.96,55.88 44.96,56.69 47.9,59.64 47.9,62.18 C7.2 47.9,62.38 41.61,68.68 | 41.61,68.68 39.57,68.68 38.56,69.7 C12.2 38.35,69.9 32.87,69.9 C11.2 32.66,69.9 31.65,70.92 30.02,70.92 29.82,70.71 29.82,68.89 32.66,66.04 32.66,62.38 C2.2 31.75,62.18 31.75,53.03 32.36,52.43 39.68,52.43 40.89,51.21 41.91,51.21 | 41.61,70.92 41.61,68.68 | 41.61,76.2 41.61,70.92 | 57.15,50.8 MSP1.43 | 18.92,31.88 13.46,26.42 11.43,26.42 10.82,25.81 10.82,24.99 13.66,22.15 | 18.92,31.88 20.37,33.33 TRANSY2.3 | 13.66,22.15 20.37,22.15 TRANSY1.3 20.57,22.15 20.98,22.15 22.2,23.37 33.17,23.37 34.39,22.15 TRANSR2.3 34.39,21.95 34.39,14.22 | IC101.4 25.04,39.22 25.04,39.62 24.03,40.64 IC101.9 | 31.34,39.22 30.33,38.2 28.7,38.2 27.89,39.01 25.25,39.01 IC101.4 | 31.34,39.22 C1.2 | 41.91,50.19 42.93,50.19 43.13,50.39 43.13,51 42.93,51.21 41.91,51.21 | J7.3 70.97,24.18 62.64,24.18 61.42,25.4 C10.2 v59.69,24.13 | LV3HP1.1 18.95,43.28 18.95,42.06 C3.- | 41.91,50.19 35.41,50.19 33.99,51.61 33.38,51.61 32.56,50.8 J8.9 J8.7 J8.5 J8.3 | 41.91,50.19 MSP1.84 | v34.39,35.15 34.39,33.53 TRANSR1.3
  Top 0.254: 21.64,38.15 20.17,39.62 20.17,40.84 19.15,41.86 C3.- | 21.64,38.15 22.81,36.98 23.62,36.98 25.04,38.41 25.04,39.01 IC101.4 | 34.39,14.22 34.29,14.12 MMW1.2 | 41.91,51.21 MSP1.82 | 34.39,14.22 34.96,14.8 38.57,14.8 39.02,15.24 GND.1 | v11.43,22.86 13.66,22.15 | J6.2 J6.3 J7.3 | J7.3 J7.2 | MSP1.15 50.46,40.7 50.46,41.59 49.53,42.52 49.53,43.18 v50.8,44.45 | v17.78,33.02 18.92,31.88 | MSP1.40 57.06,49.34 56.2,49.34 56.01,49.53 55.93,49.53 | LV3HP2.1 8.89,58.42 v8.89,53.34 | v8.89,48.26 v12.7,45.72 | LED1.C LED2.C 64.77,9.04 v64.77,13.97 | 55.93,49.53 v54.61,48.26 | 70.81,67.41 C15.C 58.24,67.72 | C13.1 18.2,49.53 19.23,48.5 20.32,48.5 | 21.59,48.5 23.42,48.5 C9.2 | 21.59,48.5 20.32,48.5 | v58.42,38.1 58.75,37.77 R5.2 58.75,29.54 v58.42,29.21 | R10.1 21.59,51.75 21.59,48.5 | v20.32,46.99 20.32,48.5 | C3.- 17.68,42.02 v16.51,43.18 | v21.59,36.83 21.64,36.88 21.64,38.15 | v33.02,36.83 31.34,38.51 31.34,39.22 | 58.24,67.72 57.26,68.69 | 58.24,67.72 58.51,67.44 58.55,67.44
  Bottom 0.254: J8.3 32.56,46.94 32.97,46.94 34.39,45.52 v34.39,35.15 33.02,35.56 v33.02,36.83 | MMW2.2 50.8,15.24 GND.1 | J1.3 J1.2 9.18,10.16 6.61,12.73 6.61,21.33 8.89,22.86 v11.43,22.86 | J7.2 SV1.2 SV1.1 v64.77,13.97 | 53.34,44.45 58.42,39.37 v58.42,38.1 | 53.34,44.45 v50.8,44.45 | v17.78,33.02 17.78,34.29 20.32,36.83 v21.59,36.83 | v58.42,29.21 58.42,25.4 v59.69,24.13 | v8.89,53.34 v8.89,48.26 | v12.7,45.72 LV3HP1.1 | v54.61,48.26 53.34,44.45 | v16.51,43.18 v20.32,46.99
  pour Bottom: -2.54,86.36 87.63,86.36 87.63,-1.27 -2.54,-1.27
N$1
  Top 0.254: TRANSY2.2 22.81,33.33 22.81,27.64 TRANSY2.4 22.81,27.43 20.78,25.4 LEDY2.1
N$2
  Top 0.254: LED1.A 60.96,4.41 59.78,5.59 59.78,7.42 61.91,9.55 R7.2
N$3
  Top 0.254: R8.2 68.49,9.93 68.49,4.84 LED2.A
N$6  (via drill 0.35)
  Top 0.254: v35.2,40.23 35,40.44 30.53,40.44 30.33,40.23 30.33,40.03 29.72,39.42 C1.1 | v39.88,47.75 40.89,48.77 MSP1.87 42.93,48.77 45.97,51.82 57.15,51.82 MSP1.45 | C2.1 30.79,62.22 v30.79,60.76 | v38.56,60.76 38.56,62.18 R1.1
  Bottom 0.254: v35.2,40.23 35.2,43.08 v39.88,47.75 39.88,60.66 39.78,60.76 v38.56,60.76 v30.79,60.76
N$7
  Top 0.254: R9.1 18.1,57.32 U2.1 22.86,62.08 24.61,62.08 26.02,61.16 26.19,61 26.19,54.77 R10.2
N$11
  Top 0.254: IC101.3 24.43,39.01 24.43,38.41 23.42,37.39 23.01,37.39 20.57,39.83 20.57,42.67 14.88,48.36 14.88,72.14 16.66,73.91 36.07,73.91 38.35,76.2 C19.1
N$34
  Top 0.254: C6.1 55.42,76.2 55.42,71.53 54.61,70.71 54.61,61.37 55.22,60.76 58.88,60.76 61.21,58.42 61.21,55.88 | 61.21,55.88 61.21,53.24 58.17,50.19 57.15,50.19 MSP1.42 | 61.21,55.88 Q1.1
N$38
  Top 0.254: 63.04,55.88 63.04,58.83 59.69,62.18 55.63,62.18 C5.1 | 63.04,55.88 63.04,54.46 58.37,49.78 57.15,49.78 MSP1.41 | 63.04,55.88 Q1.2
P1.0_LED1  (via drill 0.35)
  Top 0.254: v44.55,33.53 44.96,33.93 44.96,40.64 MSP1.4
  Bottom 0.254: v44.55,33.53 44.55,32.31 45.77,31.09 45.77,26.62 34.44,15.29 26.67,15.29 MMW1.6
P1.1_BUTTON1  (via drill 0.35)
  Top 0.254: v45.36,32.92 45.36,34.34 45.57,34.54 45.57,40.64 MSP1.5
  Bottom 0.254: v45.36,32.92 45.36,32.11 46.18,31.29 46.18,26.42 34.65,14.88 28.13,14.88 MMW1.5
P1.2_BCLUART_RXD  (via drill 0.35)
  Top 0.254: v47.4,32.11 45.77,33.73 45.77,34.14 45.97,34.34 45.97,40.64 MSP1.6
  Bottom 0.254: MMW1.4 32.61,9.3 38.1,9.3 46.99,21.95 46.99,29.43 47.4,29.84 v47.4,32.11
P1.3_BCLUART_TXD  (via drill 0.35)
  Top 0.254: v46.58,33.93 46.58,40.64 MSP1.7
  Bottom 0.254: v46.58,33.93 46.58,26.21 34.85,14.48 32.94,14.48 MMW1.3
P1.6_SPIMOSI_J2.15  (via drill 0.35)
  Top 0.254: v54.1,20.73 54.1,19.1 R3.2 | MSP1.10 47.94,40.55 47.94,39.69 46.99,38.73 46.99,35.73 50.44,32.05 v50.44,30.79
  Bottom 0.254: v54.1,20.73 54.1,21.13 50.44,24.79 v50.44,30.79 51.66,32 51.51,35.93 49.84,37.6 49.84,46.62 50.09,46.87 50.09,47.41 49.91,47.59 49.91,65.15 37.64,77.42 22.61,77.42 21.79,76.61 21.79,61.57 12.85,52.63 12.85,52.22 LV3HP1.2
P1.7_SPIMISO_J2.14  (via drill 0.35)
  Top 0.254: MSP1.11 48.6,40.58 48.6,35.61 53.34,30.87 v53.34,29.21 | R2.1 59.7,19.04 58.42,17.76 v58.42,16.51 58.42,14.85 59.33,13.94 59.33,12.04 58.84,11.54 58.84,11.52 58.78,11.47 56.45,9.14 53.35,9.14 53.2,9.13 53.19,9.14 24.99,9.14 21.69,12.44 19.51,12.44 19.05,11.98 13.71,11.98 10.41,15.28 10.41,31.5 7.62,34.29 7.62,50.38 LV3HP1.3
  Bottom 0.254: v53.34,29.21 53.34,24.13 55.88,21.59 55.88,17.78 v58.42,16.51
P2.0_RGBLED_RED  (via drill 0.35)
  Top 0.254: v51.05,43.33 51.05,40.64 MSP1.16
  Bottom 0.254: v51.05,43.33 51.05,36.98 53.13,35.35 53.13,31.97 51.26,30.09 51.26,25.16 55.47,20.95 55.47,17.88 55.44,17.81 55.47,17.71 55.47,17.57 57.59,15.45 57.59,15.24 57.86,10.57 56.44,9.14 44.44,9.14 MMW2.6
P2.1_RGBLED_GREEN  (via drill 0.35)
  Top 0.254: v50.85,35.56 51.46,36.17 51.46,40.64 MSP1.17
  Bottom 0.254: v50.85,35.56 50.85,34.75 48.62,32.51 48.62,29.87 47.8,29.06 47.8,17.71 45.72,15.63 MMW2.5
P2.2_RGBLED_BLUE  (via drill 0.35)
  Top 0.254: MSP1.18 52.16,44.21 v49.43,47.14
  Bottom 0.254: v49.43,47.14 49.43,33.93 48.21,32.72 48.21,30.07 47.4,29.26 47.4,17.88 44.65,15.14 44.65,10.23 44.81,10.23 45.31,9.73 46.13,9.73 48.26,11.86 MMW2.4
P2.3_IO_J4.34  (via drill 0.35)
  Top 0.254: v52.48,33.93 52.48,40.64 MSP1.19
  Bottom 0.254: v52.48,33.93 52.07,33.02 52.07,31.48 50.85,30.26 50.85,24.99 54.92,20.93 54.92,16.51 57.22,13.89 57.02,10.29 56.45,9.73 52.93,9.73 50.8,11.86 MMW2.3
P5.2/XT2IN  (via drill 0.35)
  Top 0.254: C12.1 40.18,69.9 38.76,71.32 29.82,71.32 29.41,70.92 29.41,54.9 30.53,53.85 Q2.1 v29.21,52.07 | MSP1.86 41.82,49.34 40.96,49.34 40.77,49.53 v36.83,49.53
  Bottom 0.254: v36.83,49.53 34.14,52.22 30.57,52.22 v29.21,52.07
P5.3/XT2OUT
  Top 0.254: C11.1 30.84,69.7 35.31,65.23 35.31,57.87 Q2.3 32.97,55.27 42.32,55.27 44.15,53.44 44.15,50.8 43.13,49.78 41.91,49.78 MSP1.85
P6.4_I2CSDA_J1.10  (via drill 0.35)
  Top 0.254: v43.33,53.24 41.91,53.24 MSP1.78 | R6.2 47.84,25.4 46.81,26.43 45.27,26.43 45.21,26.36 v42.88,26.36
  Bottom 0.254: v42.88,26.36 42.88,32.77 42.52,33.12 42.52,34.29 | 42.52,34.29 42.52,52.43 v43.33,53.24 | LV3HP2.2 12.65,64.62 10.82,62.79 10.82,44.09 11.84,43.08 14.68,43.08 19.99,37.77 20.3,37.54 29.77,37.54 33.02,34.29 42.52,34.29
P6.5_I2CSCL_J1.9  (via drill 0.35)
  Top 0.254: v43.69,25.55 43.69,24.64 45.97,22.35 45.97,19.1 R4.1 | v43.33,52.22 42.72,52.83 41.91,52.83 MSP1.79
  Bottom 0.254: v43.33,52.22 43.33,32.92 43.69,32.56 v43.69,25.55 26.92,25.55 16.51,33.02 16.51,38.1 13.69,40.92 11.58,40.92 10.43,42.06 10.41,42.06 10.41,64.62 12.65,66.85 12.65,67.26 LV3HP2.3
P7.3  (via drill 0.35 pad 0.75)
  Top 0.254: MSP1.91 42,46.85 44.65,46.85 47.99,50.19 48.53,50.19 52.07,46.65 52.07,45.72 57.15,40.64 57.15,34.53 57.65,34.04 57.65,32 57.15,31.5 v57.15,29.21 | v59.69,16.51 60.01,16.19 R7.1
  Bottom 0.254: v57.15,29.21 v59.69,16.51
P7.4
  Top 0.254: MSP1.26 57.15,41.45 59.69,38.91 59.69,28.45 44.15,28.45 39.27,33.33 TRANSR1.1
P7.5  (via drill 0.35)
  Top 0.254: MSP1.27 57.24,42.84 58.1,42.84 58.14,42.88 59.69,42.88 v60.96,40.64 | v62.23,38.1 62.23,30.48 60.1,28.35 60.1,28.28 59.76,27.94 41.91,27.94 39.3,25.33 39.3,21.66 39.13,21.83 TRANSR2.1
  Bottom 0.254: v62.23,38.1 v60.96,40.64
P7.6  (via drill 0.35)
  Top 0.254: v63.86,41.4 61.98,43.28 57.15,43.28 MSP1.28 | TRANSY1.1 25.25,21.95 30.33,16.87 30.33,10.57 31.34,9.55 55.88,9.55 58.73,12.39 58.73,13.61 v58.67,13.66
  Bottom 0.254: v63.86,41.4 63.86,18.85 v58.67,13.66
P7.7
  Top 0.254: MSP1.29 57.15,43.69 68.73,43.69 70.16,45.11 72.19,45.11 72.59,44.7 72.59,38.41 55.32,21.13 55.32,18.09 54.71,17.48 40.95,17.48 38.1,20.32 38.1,22.86 38.86,24.38 38.86,31.7 37.64,32.92 37.64,34.54 36.22,35.97 27.69,35.97 25.25,33.53 TRANSY2.1
R1
  Top 0.254: TRANSR1.4 36.83,31.9 | 36.83,31.9 TRANSR1.2 | 36.83,31.9 24.64,31.9 24.23,32.31 24.23,34.71 23.79,35.15 19.05,35.15 12.7,41.5 LEDR1.1
R2
  Top 0.254: TRANSR2.4 TRANSR2.2 36.83,22.15 35.2,23.77 32.16,23.77 23.82,32.11 23.82,34.54 23.62,34.75 19.96,34.75 19.56,34.34 12.85,34.34 LEDR2.1
TCK_SWDCLK
  Top 0.254: MSP1.95 41.91,44.7 33.78,44.7 33.38,44.3 31.14,44.3 30.12,45.31 30.12,46.13 30.94,46.94 J8.4
TDI
  Top 0.254: MSP1.92 41.91,46.33 42.93,46.33 43.13,46.13 43.13,42.06 42.72,41.66 33.17,41.66 29.72,45.11 29.72,48.16 30.94,49.38 J8.8
TDO_SWO  (via drill 0.35)
  Top 0.254: v33.78,50.8 38.86,45.72 41.91,45.72 MSP1.93
  Bottom 0.254: v33.78,50.8 32.77,51.82 30.73,51.82 30.12,51.21 30.12,49.17 30.94,48.36 J8.6
TMS_SWDIO
  Top 0.254: MSP1.94 41.91,45.31 33.78,45.31 33.17,44.7 31.75,44.7 31.14,45.31 31.14,45.72 J8.2
VCORE  (via drill 0.35)
  Top 0.254: L1.1 54.75,31.9 v55.88,30.53 54.29,30.53 49.11,35.71 49.11,40.64 MSP1.12 | 63.25,27.84 63.25,28.45 73,38.2 73,45.92 64.26,54.66 64.26,61.06 55.63,69.7 C8.1 | 63.25,27.84 63.25,25.4 C10.1 | 63.25,27.84 v63.04,27.84
  Bottom 0.254: v55.88,30.53 60.35,30.53 v63.04,27.84
VSW
  Top 0.254: MSP1.14 50.04,35.36 52.22,33.17 53.25,33.17 54.27,34.2 55.61,34.2 56.79,33.02 L1.2
XDSET_VCC  (via drill 0.35, 0.35 pad 1.2)
  Top 0.254: C7.1 45.87,62.18 | 55.73,54.66 56.13,55.07 56.13,56.69 46.04,66.79 C4.1 | 44.76,54.66 55.73,54.66 | 44.76,54.66 44.55,54.86 44.55,55.88 MSP1.73 44.45,60.96 C7.1 | 55.73,54.66 v55.73,54.46 | v23.22,38.2 23.22,39.01 IC101.1 | v20.57,38.2 19.56,39.22 19.15,39.22 C3.+ 18.24,39.27 14.48,43.03 14.48,45.52 10.82,49.17 10.82,49.78 12.04,51 13.87,51 14.48,51.61 14.48,73.66 17.02,76.2 3V.1 | 3V.1 17.73,76.2 | MSP1.13 49.53,41.91 48.26,43.18 v48.26,49.53 | v46.99,53.34 44.76,54.66 | 3V.1 21.39,76.2 22.43,75.16 23.29,75.16 24.33,76.2 C105.1 | C7.1 R1.2 40.39,62.18 40.39,59.54 v38.91,58.06 | R8.1 66.36,16.83 v67.31,17.78
  Bottom 0.254: v55.73,54.46 76.05,34.14 76.05,29.26 J6.1 76.2,28.39 72.44,24.64 72.44,23.73 67.31,18.6 v67.31,17.78 | 31.14,44.3 32.56,45.72 J8.1 | 31.14,44.3 25.04,38.2 v23.22,38.2 v20.57,38.2 | v38.91,58.06 33.83,58.06 28.45,52.68 28.45,46.99 31.14,44.3 | v48.26,49.53 v46.99,53.34
Y1
  Top 0.254: 22.81,17.88 22.81,16.26 TRANSY1.4 | 22.81,17.88 22.81,21.95 TRANSY1.2 | 22.81,17.88 12.85,17.88 LEDY1.1
(copper drawn outside any net)
  shapes: Top area x3

### Text on the board
tRestrict: S.A.S.S. Spring 2019